# Altium project LedMatrixDisplay.PRJPCB
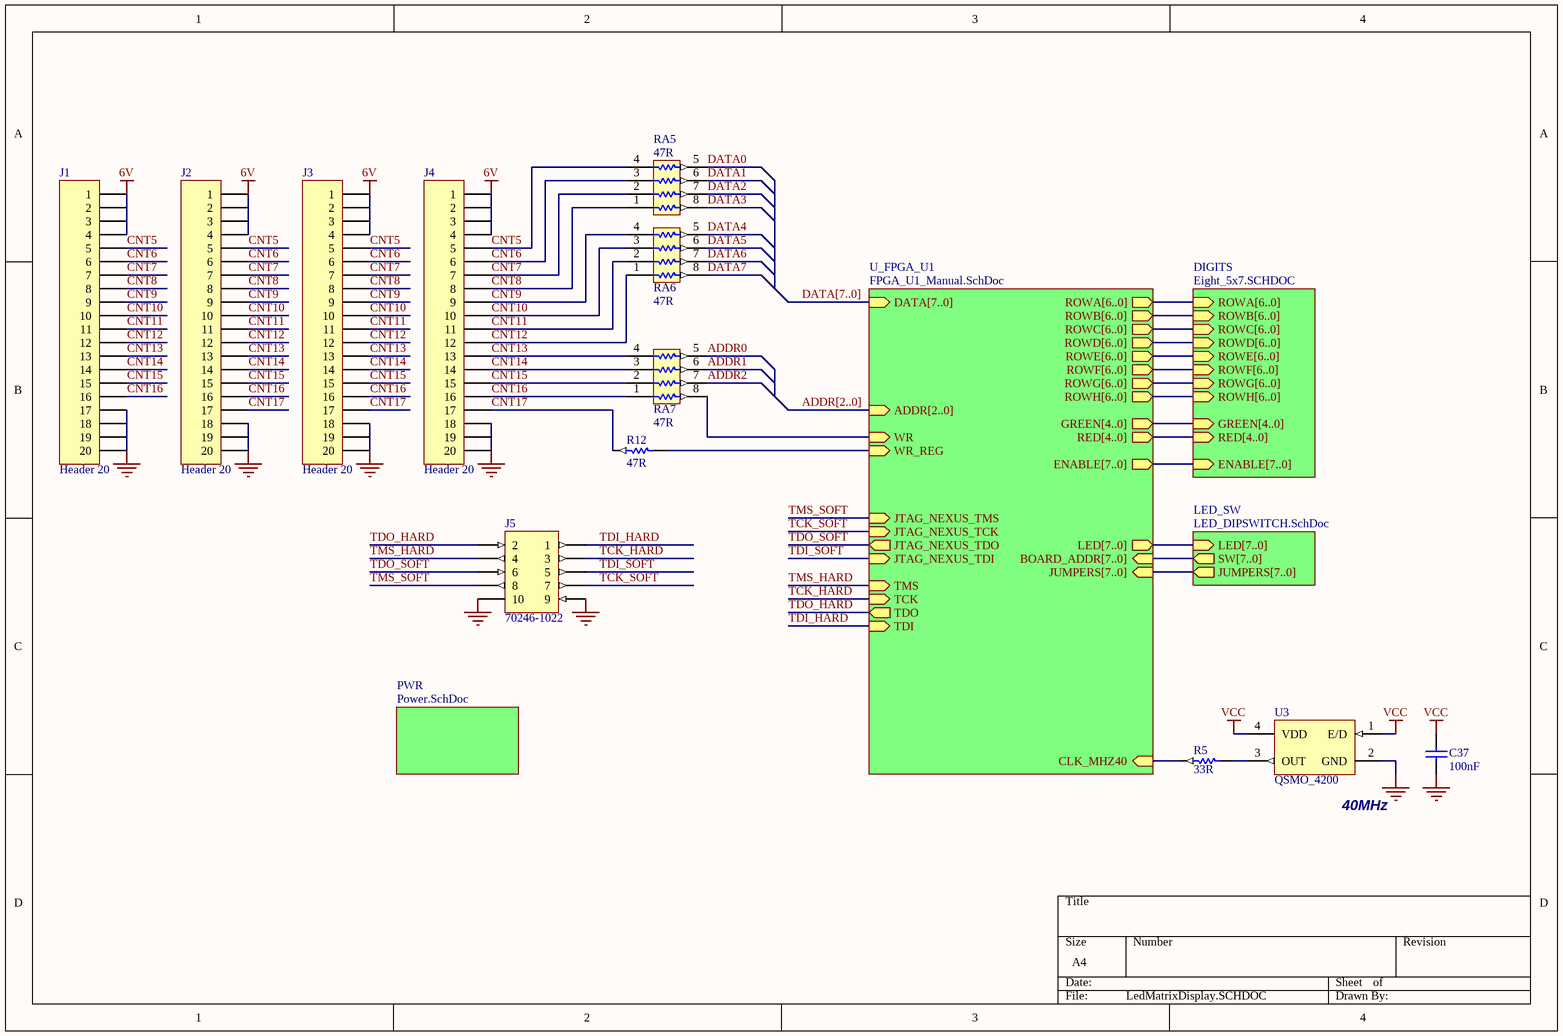
[diagram p0: LedMatrixDisplay.SCHDOC]
7 sheets, 103 parts. Net scope: hierarchical (ports join the sheet entries above them; power ports are global).
Board file: LedMatrixDisplay.PCBDOC
Sheets:
  LedMatrixDisplay.SCHDOC
    DIGITS = Eight_5x7.SCHDOC
      DG7 = DigitHolder.SCHDOC
      DG6 = DigitHolder.SCHDOC
      DG5 = DigitHolder.SCHDOC
      DG4 = DigitHolder.SCHDOC
      DG3 = DigitHolder.SCHDOC
      DG2 = DigitHolder.SCHDOC
      DG1 = DigitHolder.SCHDOC
      DG8 = DigitHolder.SCHDOC
    U_FPGA_U1 = FPGA_U1_Manual.SchDoc
      U_FPGA_U1_Auto = FPGA_U1_Auto.SchDoc
    PWR = Power.SchDoc
    LED_SW = LED_DIPSWITCH.SchDoc

## Sheet LedMatrixDisplay.SCHDOC
size A4; DocumentNumber: 1; SheetNumber: 1; SheetTotal: 7

### Parts
C37  100nF  [CC2012-0805]
J1  Header 20  [HDR2X10]
J2  Header 20  [HDR2X10]
J3  Header 20  [HDR2X10]
J4  Header 20  [HDR2X10]
J5  70246-1022  [HDR2X5_LP]
R5  33R  [CC2012-0805]
R12  47R  [CC2012-0805]
RA5  47R  [MNR34]
RA6  47R  [MNR34]
RA7  47R  [MNR34]
U3  QSMO_4200  [QSMO_4200]

### Sub-sheets
DIGITS = Eight_5x7.SCHDOC: ROWB[6..0] (in), ROWC[6..0] (in), ROWD[6..0] (in), ROWF[6..0] (in), ROWG[6..0] (in), ROWH[6..0] (in), ROWE[6..0] (in), ROWA[6..0] (in), GREEN[4..0] (in), RED[4..0] (in), ENABLE[7..0] (in)
LED_SW = LED_DIPSWITCH.SchDoc: LED[7..0] (in), SW[7..0] (out), JUMPERS[7..0] (out)
PWR = Power.SchDoc: no entries
U_FPGA_U1 = FPGA_U1_Manual.SchDoc: CLK_MHZ40 (in), DATA[7..0] (in), GREEN[4..0] (out), JTAG_NEXUS_TCK (in), JTAG_NEXUS_TDI (in), JTAG_NEXUS_TDO (out), JTAG_NEXUS_TMS (in), RED[4..0] (out), ADDR[2..0] (in), ROWA[6..0] (out), ROWB[6..0] (out), ROWC[6..0] (out), ROWD[6..0] (out), ROWE[6..0] (out), ROWF[6..0] (out), ROWG[6..0] (out), ROWH[6..0] (out), WR (in), TCK (in), TDI (in), TDO (out), TMS (in), BOARD_ADDR[7..0] (in), LED[7..0] (out), ENABLE[7..0] (out), JUMPERS[7..0] (in), WR_REG (in)

### Nets
6V: J1.1 J1.2 J1.3 J1.4 J2.1 J2.2 J2.3 J2.4 J3.1 J3.2 J3.3 J3.4 J4.1 J4.2 J4.3 J4.4
GND: C37.2 J1.17 J1.18 J1.19 J1.20 J2.18 J2.19 J2.20 J3.18 J3.19 J3.20 J4.18 J4.19 J4.20 J5.9 J5.10 U3.2(GND)
VCC: C37.1 U3.1(E/D) U3.4(VDD)  [project net VCCO]
ADDR0: RA7.5
ADDR1: RA7.6
ADDR2: RA7.7
CLK_MHZ40: R5.2 ; sheet U_FPGA_U1/CLK_MHZ40
CNT5: J1.5 J2.5 J3.5 J4.5 RA5.4
CNT6: J1.6 J2.6 J3.6 J4.6 RA5.3
CNT7: J1.7 J2.7 J3.7 J4.7 RA5.2
CNT8: J1.8 J2.8 J3.8 J4.8 RA5.1
CNT9: J1.9 J2.9 J3.9 J4.9 RA6.4
CNT10: J1.10 J2.10 J3.10 J4.10 RA6.3
CNT11: J1.11 J2.11 J3.11 J4.11 RA6.2
CNT12: J1.12 J2.12 J3.12 J4.12 RA6.1
CNT13: J1.13 J2.13 J3.13 J4.13 RA7.4
CNT14: J1.14 J2.14 J3.14 J4.14 RA7.3
CNT15: J1.15 J2.15 J3.15 J4.15 RA7.2
CNT16: J1.16 J2.16 J3.16 J4.16 RA7.1
CNT17: J2.17 J3.17 J4.17 R12.2
DATA0: RA5.5
DATA1: RA5.6
DATA2: RA5.7
DATA3: RA5.8
DATA4: RA6.5
DATA5: RA6.6
DATA6: RA6.7
DATA7: RA6.8
TCK_HARD: J5.3 ; sheet U_FPGA_U1/TCK
TCK_SOFT: J5.7 ; sheet U_FPGA_U1/JTAG_NEXUS_TCK
TDI_HARD: J5.1 ; sheet U_FPGA_U1/TDI
TDI_SOFT: J5.5 ; sheet U_FPGA_U1/JTAG_NEXUS_TDI
TDO_HARD: J5.2 ; sheet U_FPGA_U1/TDO
TDO_SOFT: J5.6 ; sheet U_FPGA_U1/JTAG_NEXUS_TDO
TMS_HARD: J5.4 ; sheet U_FPGA_U1/TMS
TMS_SOFT: J5.8 ; sheet U_FPGA_U1/JTAG_NEXUS_TMS
WR: RA7.8 ; sheet U_FPGA_U1/WR
WR_REG: R12.1 ; sheet U_FPGA_U1/WR_REG
NetR5_1: R5.1 U3.3(OUT)

### Buses and harness runs
bus ADDR[2..0] = sheet U_FPGA_U1/ADDR[2..0]
bus DATA[7..0] = sheet U_FPGA_U1/DATA[7..0]
bus sheet DIGITS/ENABLE[7..0] = sheet U_FPGA_U1/ENABLE[7..0]
bus sheet DIGITS/GREEN[4..0] = sheet U_FPGA_U1/GREEN[4..0]
bus sheet DIGITS/RED[4..0] = sheet U_FPGA_U1/RED[4..0]
bus sheet DIGITS/ROWA[6..0] = sheet U_FPGA_U1/ROWA[6..0]
bus sheet DIGITS/ROWB[6..0] = sheet U_FPGA_U1/ROWB[6..0]
bus sheet DIGITS/ROWC[6..0] = sheet U_FPGA_U1/ROWC[6..0]
bus sheet DIGITS/ROWD[6..0] = sheet U_FPGA_U1/ROWD[6..0]
bus sheet DIGITS/ROWE[6..0] = sheet U_FPGA_U1/ROWE[6..0]
bus sheet DIGITS/ROWF[6..0] = sheet U_FPGA_U1/ROWF[6..0]
bus sheet DIGITS/ROWG[6..0] = sheet U_FPGA_U1/ROWG[6..0]
bus sheet DIGITS/ROWH[6..0] = sheet U_FPGA_U1/ROWH[6..0]
bus sheet LED_SW/JUMPERS[7..0] = sheet U_FPGA_U1/JUMPERS[7..0]
bus sheet LED_SW/LED[7..0] = sheet U_FPGA_U1/LED[7..0]
bus sheet LED_SW/SW[7..0] = sheet U_FPGA_U1/BOARD_ADDR[7..0]

### Notes on the sheet
- (near U3) 40MHz

### Library data of the parts
C37 = CAP: Capacitor; Fitted: False
J1-J4 = Header 20: Header, 20-Pin; Manufacturer: Generic Components; Class I: Connector; Revision: July-2002: Re-released for DXP Platform.; Publisher: Altium Limited
J5 = Header 5X2: Header, 5-Pin, Dual row; Manufacturer: Molex; Class I: Connector; Fitted: True; Revision: July-2002: Re-released for DXP Platform.; Publisher: Altium Limited
R5 R12 = RES: Resistor; Fitted: False
RA5-RA7 = MNR34: 3216x4 Resistor Array; Fitted: True
U3 = QSMO_4200: Surface Mount Crystal Oscillator; Fitted: False

## Sheet Eight_5x7.SCHDOC
size A4 portrait; Organization: Altium Limited; Address1: L3, 12a Rodborough Rd; Address2: Frenchs Forest; Address3: NSW; Address4: Australia 2086; DocumentNumber: 2; SheetNumber: 2; SheetTotal: 7
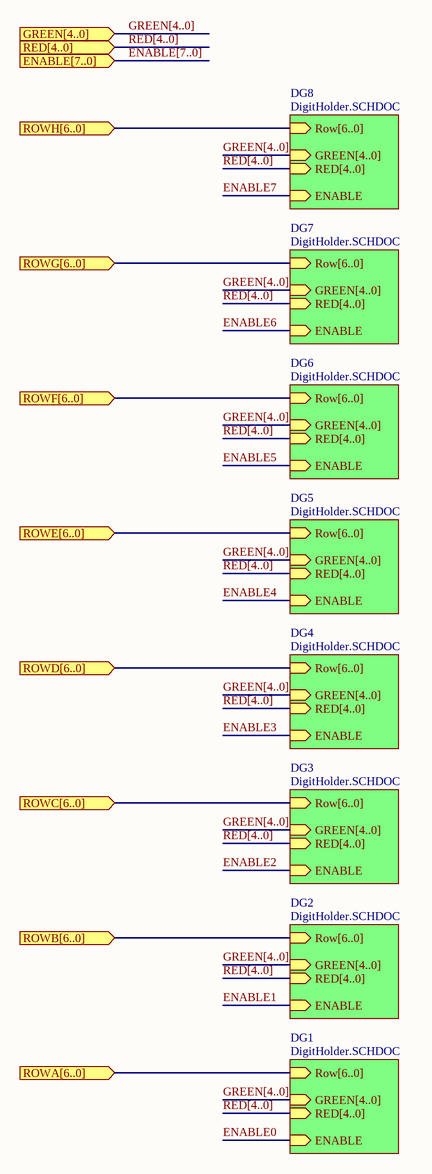
[diagram p1: Eight_5x7.SCHDOC]

### Sub-sheets
DG1 = DigitHolder.SCHDOC: Row[6..0] (in), ENABLE (in), GREEN[4..0] (in), RED[4..0] (in)
DG2 = DigitHolder.SCHDOC: Row[6..0] (in), ENABLE (in), GREEN[4..0] (in), RED[4..0] (in)
DG3 = DigitHolder.SCHDOC: Row[6..0] (in), ENABLE (in), GREEN[4..0] (in), RED[4..0] (in)
DG4 = DigitHolder.SCHDOC: Row[6..0] (in), ENABLE (in), GREEN[4..0] (in), RED[4..0] (in)
DG5 = DigitHolder.SCHDOC: Row[6..0] (in), ENABLE (in), GREEN[4..0] (in), RED[4..0] (in)
DG6 = DigitHolder.SCHDOC: Row[6..0] (in), ENABLE (in), GREEN[4..0] (in), RED[4..0] (in)
DG7 = DigitHolder.SCHDOC: Row[6..0] (in), ENABLE (in), GREEN[4..0] (in), RED[4..0] (in)
DG8 = DigitHolder.SCHDOC: Row[6..0] (in), ENABLE (in), GREEN[4..0] (in), RED[4..0] (in)

### Ports
ENABLE[7..0] (in), GREEN[4..0] (in), RED[4..0] (in), ROWA[6..0] (in), ROWB[6..0] (in), ROWC[6..0] (in), ROWD[6..0] (in), ROWE[6..0] (in), ROWF[6..0] (in), ROWG[6..0] (in), ROWH[6..0] (in)

### Buses and harness runs
bus ENABLE[7..0] = port ENABLE[7..0]
bus GREEN[4..0] = port GREEN[4..0]
bus GREEN[4..0] = sheet DG1/GREEN[4..0]
bus GREEN[4..0] = sheet DG2/GREEN[4..0]
bus GREEN[4..0] = sheet DG3/GREEN[4..0]
bus GREEN[4..0] = sheet DG4/GREEN[4..0]
bus GREEN[4..0] = sheet DG5/GREEN[4..0]
bus GREEN[4..0] = sheet DG6/GREEN[4..0]
bus GREEN[4..0] = sheet DG7/GREEN[4..0]
bus GREEN[4..0] = sheet DG8/GREEN[4..0]
bus port ROWA[6..0] = sheet DG1/Row[6..0]
bus port ROWB[6..0] = sheet DG2/Row[6..0]
bus port ROWC[6..0] = sheet DG3/Row[6..0]
bus port ROWD[6..0] = sheet DG4/Row[6..0]
bus port ROWE[6..0] = sheet DG5/Row[6..0]
bus port ROWF[6..0] = sheet DG6/Row[6..0]
bus port ROWG[6..0] = sheet DG7/Row[6..0]
bus port ROWH[6..0] = sheet DG8/Row[6..0]
bus RED[4..0] = port RED[4..0]
bus RED[4..0] = sheet DG1/RED[4..0]
bus RED[4..0] = sheet DG2/RED[4..0]
bus RED[4..0] = sheet DG3/RED[4..0]
bus RED[4..0] = sheet DG4/RED[4..0]
bus RED[4..0] = sheet DG5/RED[4..0]
bus RED[4..0] = sheet DG6/RED[4..0]
bus RED[4..0] = sheet DG7/RED[4..0]
bus RED[4..0] = sheet DG8/RED[4..0]

### Notes on the sheet
- Title
- Size:
- Date:
- A4
- Number:
- Time:
- Revision:
- Sheet
- of
- File:

## Sheet DigitHolder.SCHDOC
size A4; DocumentNumber: 6; SheetNumber: 6; SheetTotal: 7
Used 8 times, as channels DIGITS/DG7, DIGITS/DG6, DIGITS/DG5, DIGITS/DG4, DIGITS/DG3, DIGITS/DG2, DIGITS/DG1, DIGITS/DG8. Parts and nets are listed once, with the designators drawn on the sheet.
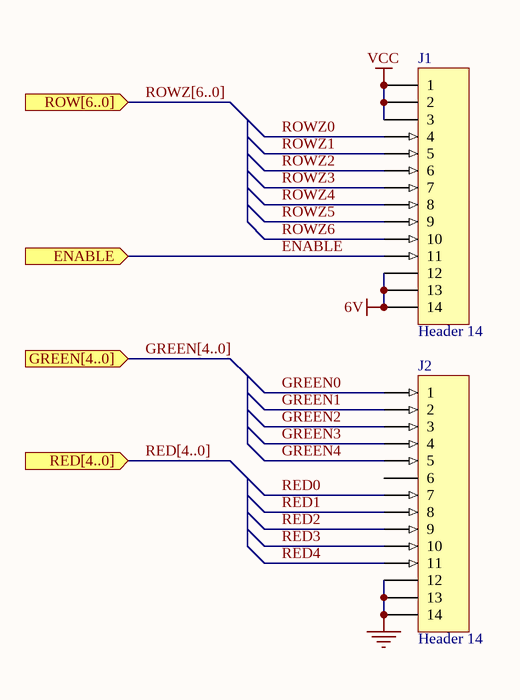
[diagram p2: DigitHolder.SCHDOC]

### Parts
J1  Header 14  [HDR1X14]
J2  Header 14  [HDR1X14]

### Ports
ENABLE (in), GREEN[4..0] (in), RED[4..0] (in), ROW[6..0] (in)

### Nets
6V: J1.12 J1.13 J1.14
GND: J2.12 J2.13 J2.14
VCC: J1.1 J1.2 J1.3
ENABLE: J1.11 ; port ENABLE
GREEN0: J2.1
GREEN1: J2.2
GREEN2: J2.3
GREEN3: J2.4
GREEN4: J2.5
RED0: J2.7
RED1: J2.8
RED2: J2.9
RED3: J2.10
RED4: J2.11
ROWZ0: J1.4
ROWZ1: J1.5
ROWZ2: J1.6
ROWZ3: J1.7
ROWZ4: J1.8
ROWZ5: J1.9
ROWZ6: J1.10

Not connected (* = marked no-connect by the designer): J2 6

### Channels
DIGITS/DG7: designators end in _DG7; ports ENABLE=ENABLE6
DIGITS/DG6: designators end in _DG6; ports ENABLE=ENABLE5
DIGITS/DG5: designators end in _DG5; ports ENABLE=ENABLE4
DIGITS/DG4: designators end in _DG4; ports ENABLE=ENABLE3
DIGITS/DG3: designators end in _DG3; ports ENABLE=ENABLE2
DIGITS/DG2: designators end in _DG2; ports ENABLE=ENABLE1
DIGITS/DG1: designators end in _DG1; ports ENABLE=ENABLE0
DIGITS/DG8: designators end in _DG8; ports ENABLE=ENABLE7

### Buses and harness runs
bus GREEN[4..0] = port GREEN[4..0]
bus RED[4..0] = port RED[4..0]
bus ROWZ[6..0] = port ROW[6..0]

### Library data of the parts
J1 J2 = Header 14: Header, 14-Pin; Manufacturer: Generic Components; Class I: Connector; Revision: July-2002: Re-released for DXP Platform.; Publisher: Altium Limited

## Sheet FPGA_U1_Manual.SchDoc
size A4; DocumentNumber: 4; SheetNumber: 4; SheetTotal: 7
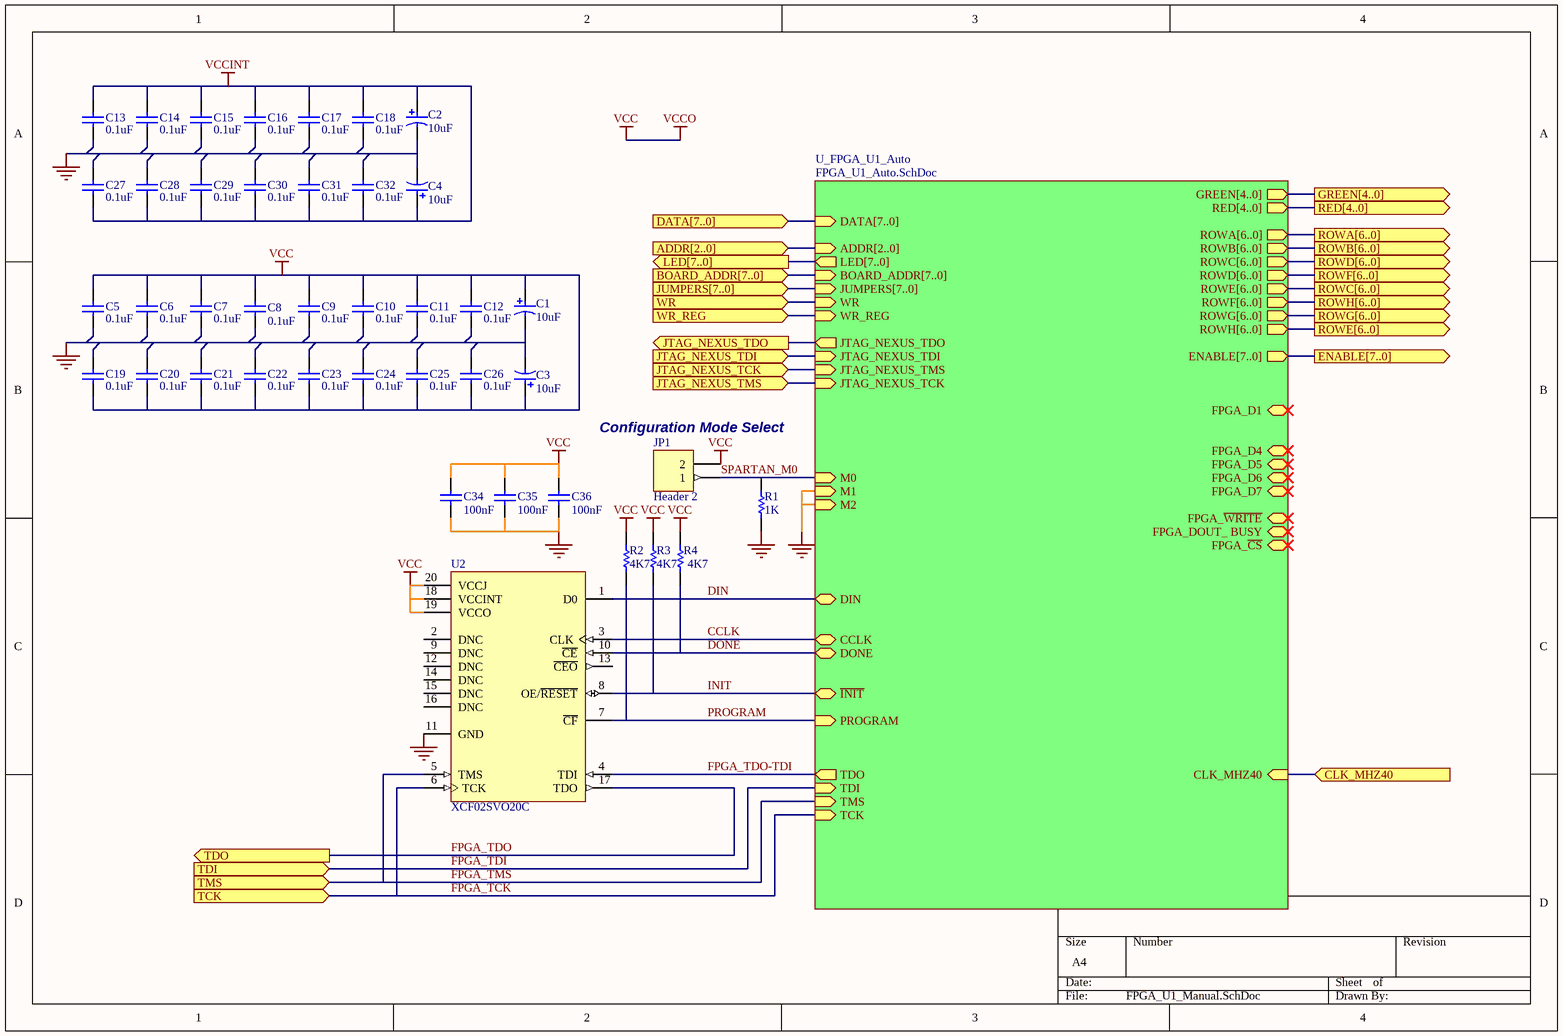
[diagram p3: FPGA_U1_Manual.SchDoc]

### Parts
C1  10uF  [MCCT-B]
C2  10uF  [MCCT-B]
C3  10uF  [MCCT-B]
C4  10uF  [MCCT-B]
C5  0.1uF  [CC2012-0805]
C6  0.1uF  [CC2012-0805]
C7  0.1uF  [CC2012-0805]
C8  0.1uF  [CC2012-0805]
C9  0.1uF  [CC2012-0805]
C10  0.1uF  [CC2012-0805]
C11  0.1uF  [CC2012-0805]
C12  0.1uF  [CC2012-0805]
C13  0.1uF  [CC2012-0805]
C14  0.1uF  [CC2012-0805]
C15  0.1uF  [CC2012-0805]
C16  0.1uF  [CC2012-0805]
C17  0.1uF  [CC2012-0805]
C18  0.1uF  [CC2012-0805]
C19  0.1uF  [CC2012-0805]
C20  0.1uF  [CC2012-0805]
C21  0.1uF  [CC2012-0805]
C22  0.1uF  [CC2012-0805]
C23  0.1uF  [CC2012-0805]
C24  0.1uF  [CC2012-0805]
C25  0.1uF  [CC2012-0805]
C26  0.1uF  [CC2012-0805]
C27  0.1uF  [CC2012-0805]
C28  0.1uF  [CC2012-0805]
C29  0.1uF  [CC2012-0805]
C30  0.1uF  [CC2012-0805]
C31  0.1uF  [CC2012-0805]
C32  0.1uF  [CC2012-0805]
C34  100nF  [CC2012-0805]
C35  100nF  [CC2012-0805]
C36  100nF  [CC2012-0805]
JP1  Header 2  Usage: Configuration Mode Select  [HDR1X2]
R1  1K  [CC2012-0805]
R2  4K7  [CC2012-0805]
R3  4K7  [CC2012-0805]
R4  4K7  [CC2012-0805]
U2  XCF02SVO20C  [VO20]

### Sub-sheets
U_FPGA_U1_Auto = FPGA_U1_Auto.SchDoc: ADDR[2..0] (in), BOARD_ADDR[7..0] (in), CLK_MHZ40 (in), DATA[7..0] (in), GREEN[4..0] (out), JTAG_NEXUS_TCK (in), JTAG_NEXUS_TDI (in), JTAG_NEXUS_TDO (out), JTAG_NEXUS_TMS (in), LED[7..0] (out), RED[4..0] (out), ROWA[6..0] (out), ROWB[6..0] (out), ROWC[6..0] (out), ROWD[6..0] (out), ROWE[6..0] (out), ROWF[6..0] (out), ROWG[6..0] (out), ROWH[6..0] (out), WR (in), CCLK (bidir), DONE (bidir), FPGA_D7 (bidir), M0 (in), M1 (in), M2 (in), PROGRAM (in), TCK (in), TDI (in), TDO (out), TMS (in), FPGA_DOUT_ BUSY (bidir), FPGA_~{WRITE} (bidir), FPGA_D5 (bidir), FPGA_D6 (bidir), FPGA_~{CS} (bidir), FPGA_D1 (bidir), FPGA_D4 (bidir), ENABLE[7..0] (out), JUMPERS[7..0] (in), DIN (bidir), ~{INIT} (bidir), WR_REG (in)

### Ports
ADDR[2..0] (in), BOARD_ADDR[7..0] (in), CLK_MHZ40 (in), DATA[7..0] (in), ENABLE[7..0] (out), GREEN[4..0] (out), JTAG_NEXUS_TCK (in), JTAG_NEXUS_TDI (in), JTAG_NEXUS_TDO (out), JTAG_NEXUS_TMS (in), JUMPERS[7..0] (in), LED[7..0] (out), RED[4..0] (out), ROWA[6..0] (out), ROWB[6..0] (out), ROWC[6..0] (out), ROWD[6..0] (out), ROWE[6..0] (out), ROWF[6..0] (out), ROWG[6..0] (out), ROWH[6..0] (out), TCK (in), TDI (in), TDO (out), TMS (in), WR (in), WR_REG (in)

### Nets
GND: C1.2 C2.2 C3.2 C4.2 C5.1 C6.1 C7.1 C8.1 C9.1 C10.1 C11.1 C12.1 C13.1 C14.1 C15.1 C16.1 C17.1 C18.1 C19.2 C20.2 C21.2 C22.2 C23.2 C24.2 C25.2 C26.2 C27.2 C28.2 C29.2 C30.2 C31.2 C32.2 C34.1 C35.1 C36.1 R1.1 U2.11(GND) ; sheet U_FPGA_U1_Auto/M1, sheet U_FPGA_U1_Auto/M2
VCCINT: C2.1 C4.1 C13.2 C14.2 C15.2 C16.2 C17.2 C18.2 C27.1 C28.1 C29.1 C30.1 C31.1 C32.1
VCCO: C1.1 C3.1 C5.2 C6.2 C7.2 C8.2 C9.2 C10.2 C11.2 C12.2 C19.1 C20.1 C21.1 C22.1 C23.1 C24.1 C25.1 C26.1 C34.2 C35.2 C36.2 JP1.2 R2.1 R3.1 R4.1 U2.18(VCCINT) U2.19(VCCO) U2.20(VCCJ)  [also labelled VCC]
CCLK: U2.3(CLK) ; sheet U_FPGA_U1_Auto/CCLK
CLK_MHZ40: port CLK_MHZ40, sheet U_FPGA_U1_Auto/CLK_MHZ40
DIN: U2.1(D0) ; sheet U_FPGA_U1_Auto/DIN
DONE: R4.2 U2.10(~{CE}) ; sheet U_FPGA_U1_Auto/DONE
FPGA_TCK: U2.6(TCK) ; port TCK, sheet U_FPGA_U1_Auto/TCK  [project net TCK_HARD]
FPGA_TDI: port TDI, sheet U_FPGA_U1_Auto/TDI  [project net TDI_HARD]
FPGA_TDO: U2.17(TDO) ; port TDO  [project net TDO_HARD]
FPGA_TDO-TDI: U2.4(TDI) ; sheet U_FPGA_U1_Auto/TDO
FPGA_TMS: U2.5(TMS) ; port TMS, sheet U_FPGA_U1_Auto/TMS  [project net TMS_HARD]
INIT: R3.2 U2.8(OE/~{RESET}) ; sheet U_FPGA_U1_Auto/~{INIT}
PROGRAM: R2.2 U2.7(~{CF}) ; sheet U_FPGA_U1_Auto/PROGRAM
SPARTAN_M0: JP1.1 R1.2 ; sheet U_FPGA_U1_Auto/M0
TCK_SOFT: port JTAG_NEXUS_TCK, sheet U_FPGA_U1_Auto/JTAG_NEXUS_TMS
TDI_SOFT: port JTAG_NEXUS_TDI, sheet U_FPGA_U1_Auto/JTAG_NEXUS_TDI
TDO_SOFT: port JTAG_NEXUS_TDO, sheet U_FPGA_U1_Auto/JTAG_NEXUS_TDO
TMS_SOFT: port JTAG_NEXUS_TMS, sheet U_FPGA_U1_Auto/JTAG_NEXUS_TCK
WR: port WR, sheet U_FPGA_U1_Auto/WR
WR_REG: port WR_REG, sheet U_FPGA_U1_Auto/WR_REG

Not connected (* = marked no-connect by the designer): U2 2(DNC) 9(DNC) 12(DNC) 13(~{CEO}) 14(DNC) 15(DNC) 16(DNC)

### Buses and harness runs
bus port ADDR[2..0] = sheet U_FPGA_U1_Auto/ADDR[2..0]
bus port BOARD_ADDR[7..0] = sheet U_FPGA_U1_Auto/BOARD_ADDR[7..0]
bus port DATA[7..0] = sheet U_FPGA_U1_Auto/DATA[7..0]
bus port ENABLE[7..0] = sheet U_FPGA_U1_Auto/ENABLE[7..0]
bus port GREEN[4..0] = sheet U_FPGA_U1_Auto/GREEN[4..0]
bus port JUMPERS[7..0] = sheet U_FPGA_U1_Auto/JUMPERS[7..0]
bus port LED[7..0] = sheet U_FPGA_U1_Auto/LED[7..0]
bus port RED[4..0] = sheet U_FPGA_U1_Auto/RED[4..0]
bus port ROWA[6..0] = sheet U_FPGA_U1_Auto/ROWA[6..0]
bus port ROWB[6..0] = sheet U_FPGA_U1_Auto/ROWB[6..0]
bus port ROWC[6..0] = sheet U_FPGA_U1_Auto/ROWE[6..0]
bus port ROWD[6..0] = sheet U_FPGA_U1_Auto/ROWC[6..0]
bus port ROWE[6..0] = sheet U_FPGA_U1_Auto/ROWH[6..0]
bus port ROWF[6..0] = sheet U_FPGA_U1_Auto/ROWD[6..0]
bus port ROWG[6..0] = sheet U_FPGA_U1_Auto/ROWG[6..0]
bus port ROWH[6..0] = sheet U_FPGA_U1_Auto/ROWF[6..0]

### Library data of the parts
C1-C4 = CAP_POLAR: Polar Capacitor
  C2-C4: Supplier: FARNELL; Supplier Code: 967-117
C5-C32 = CAP: Capacitor; Supplier: FARNELL; Supplier Code: 317-287
C34-C36 = CAP: Capacitor; Fitted: True
JP1 = Header 2: Header, 2-Pin; Manufacturer: Generic Components; Class I: Connector; Fitted: True; Revision: July-2002: Re-released for DXP Platform.; Publisher: Altium Limited
R1-R4 = RES: Resistor; Fitted: True
U2 = XCF02SVO20C: XCF00S Series, Platform Flash In-System Programmable Configuration 3.3V PROM, 20-Pin TSOP, 2-Megabit, Commercial Grade; Manufacturer: Xilinx; Package Information: Latest Revision: ver1.0, May-2003; Code - JEDEC: MO-153-AC; Published: 17-Sep-2003; Datasheet: Latest Revision: ver1.1, Jun-2003; Package Reference: VO20; Publisher: Altium Limited

## Sheet FPGA_U1_Auto.SchDoc
size A2; DocumentNumber: 7; SheetNumber: 7; SheetTotal: 7; Generated From FPGA Project: LedMatrix.PrjFpg; UNUSED_SPECIAL: RouteSeparate; UNUSED_IO: NoERC; VREF: NoERC; UNUSED_INPUT: NoERC
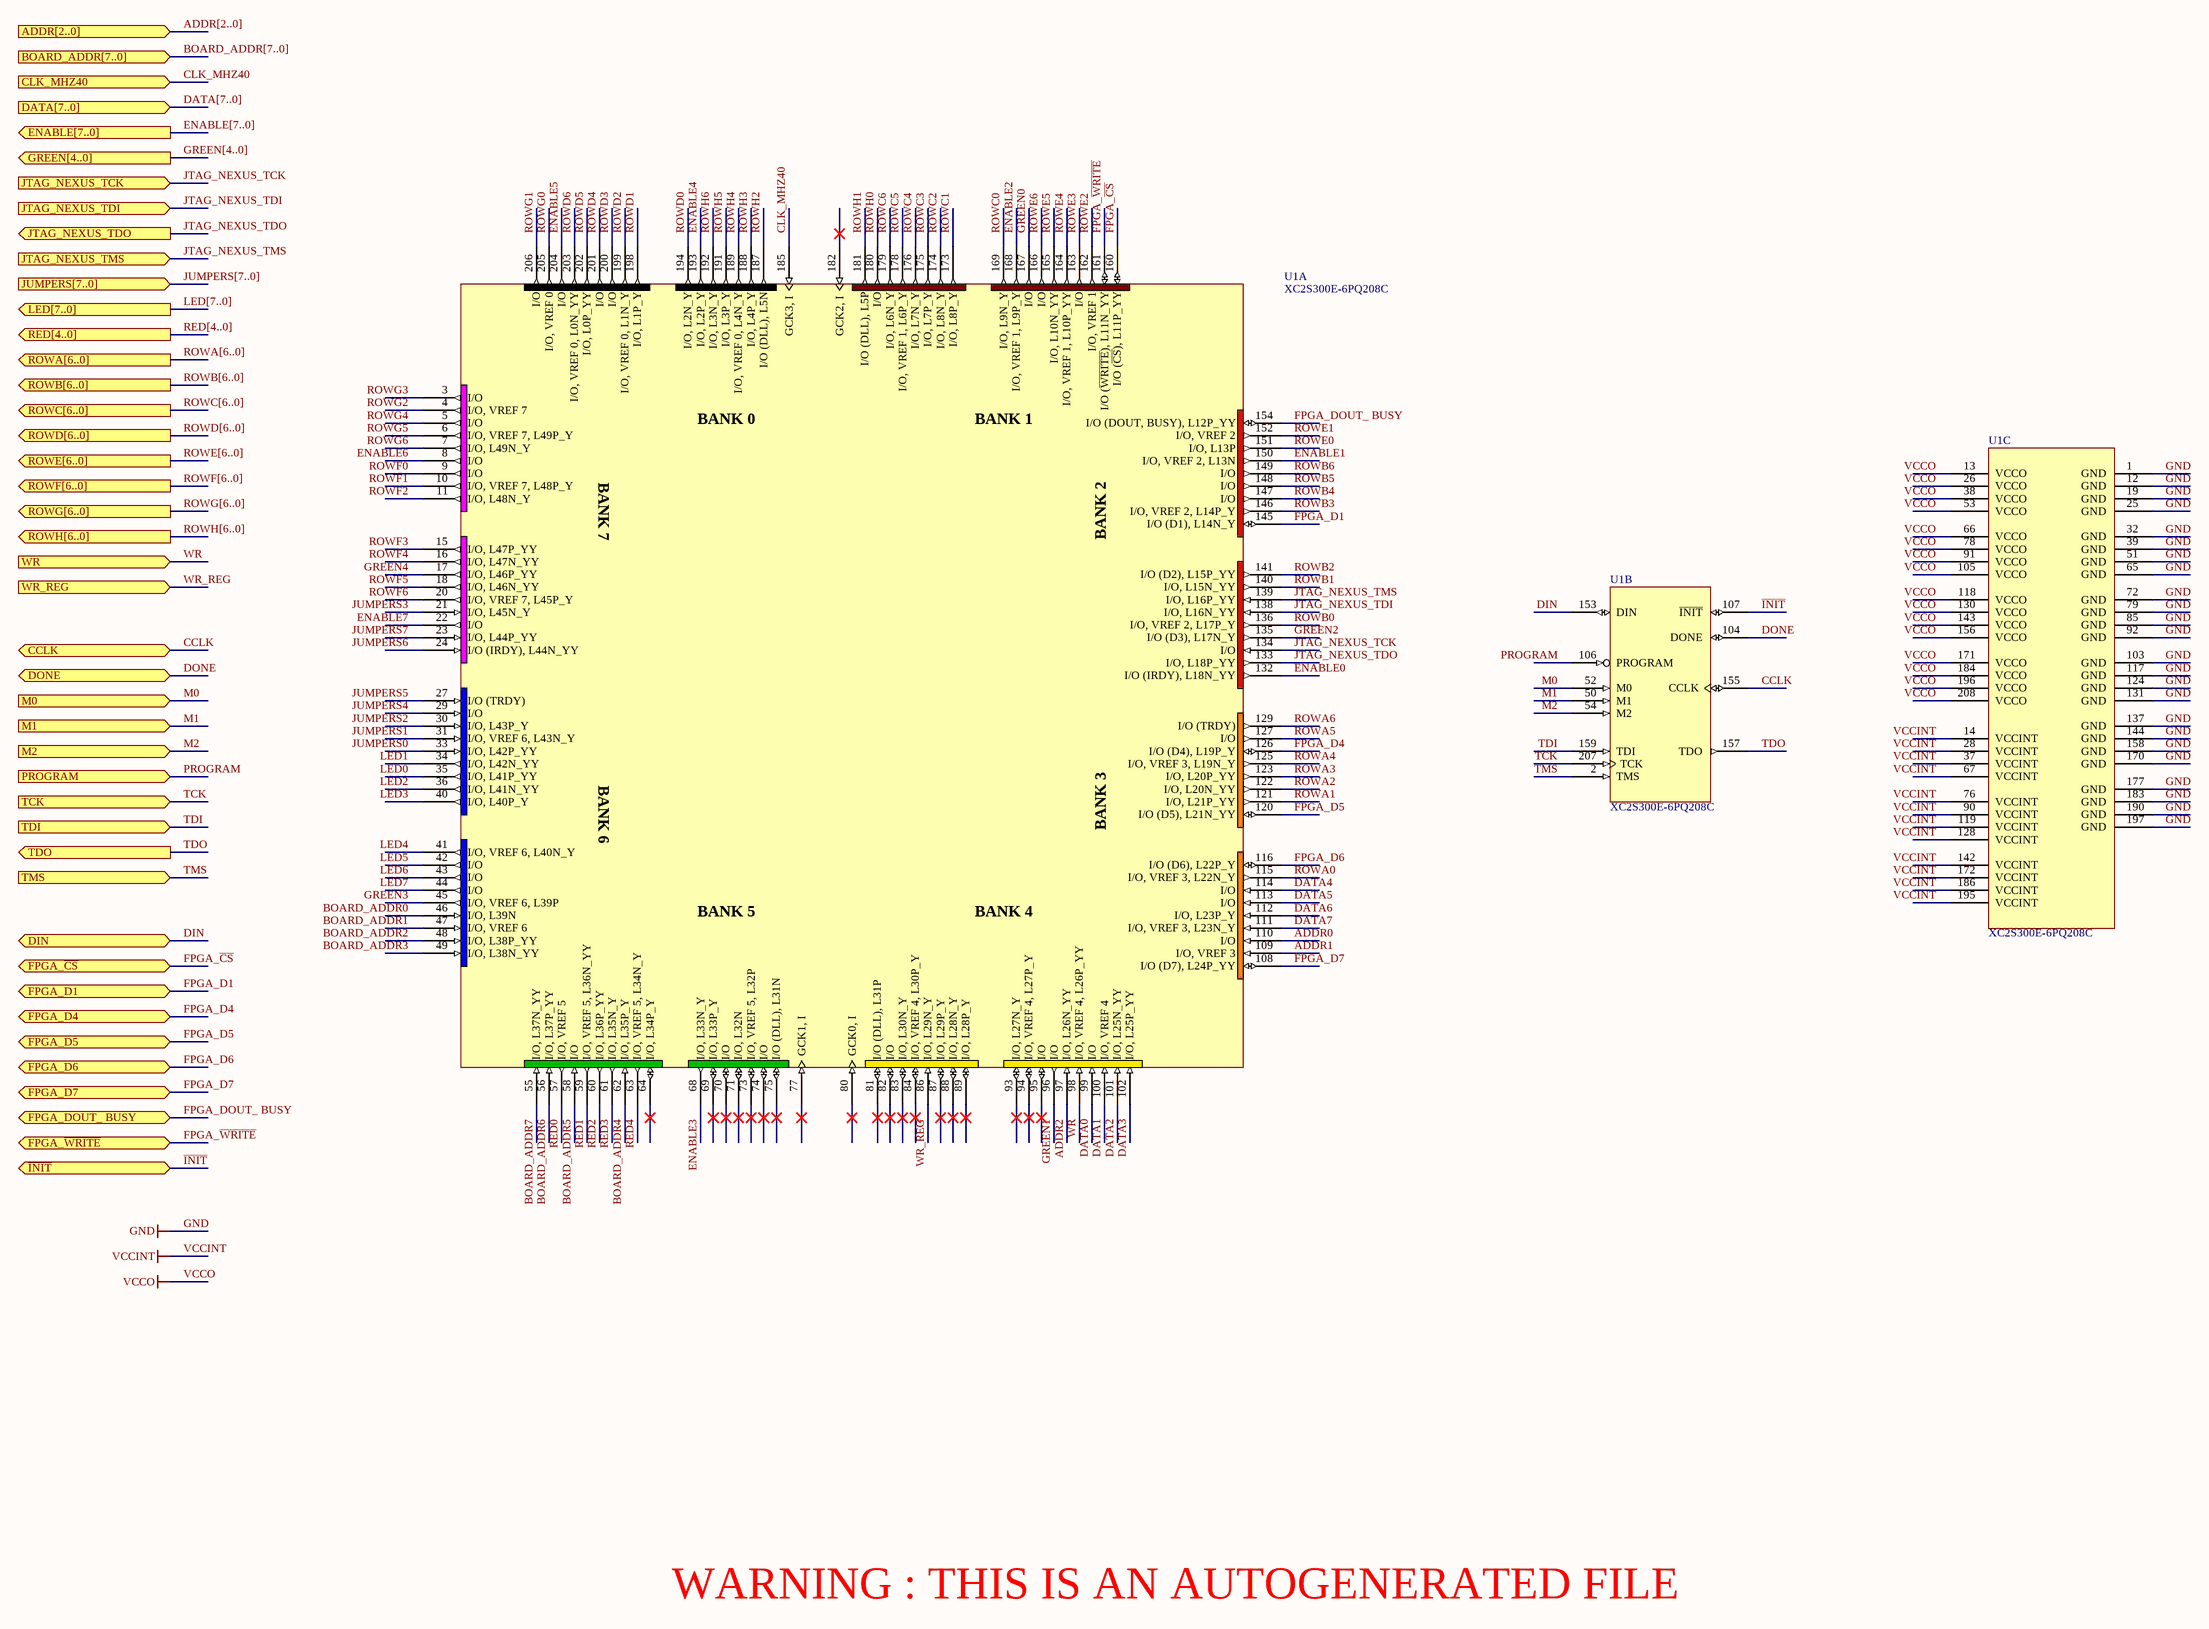
[diagram p4: FPGA_U1_Auto.SchDoc]

### Parts
U1  XC2S300E-6PQ208C  [PQ208]  (parts A,B,C of 3)

### Ports
ADDR[2..0] (in), BOARD_ADDR[7..0] (in), CCLK (bidir), CLK_MHZ40 (in), DATA[7..0] (in), DIN (bidir), DONE (bidir), ENABLE[7..0] (out), FPGA_D1 (bidir), FPGA_D4 (bidir), FPGA_D5 (bidir), FPGA_D6 (bidir), FPGA_D7 (bidir), FPGA_DOUT_ BUSY (bidir), FPGA_~{CS} (bidir), FPGA_~{WRITE} (bidir), GREEN[4..0] (out), JTAG_NEXUS_TCK (in), JTAG_NEXUS_TDI (in), JTAG_NEXUS_TDO (out), JTAG_NEXUS_TMS (in), JUMPERS[7..0] (in), LED[7..0] (out), M0 (in), M1 (in), M2 (in), PROGRAM (in), RED[4..0] (out), ROWA[6..0] (out), ROWB[6..0] (out), ROWC[6..0] (out), ROWD[6..0] (out), ROWE[6..0] (out), ROWF[6..0] (out), ROWG[6..0] (out), ROWH[6..0] (out), TCK (in), TDI (in), TDO (out), TMS (in), WR (in), WR_REG (in), ~{INIT} (bidir)

### Nets
GND: U1.1(GND) U1.12(GND) U1.19(GND) U1.25(GND) U1.32(GND) U1.39(GND) U1.50(M1) U1.51(GND) U1.54(M2) U1.65(GND) U1.72(GND) U1.79(GND) U1.85(GND) U1.92(GND) U1.103(GND) U1.117(GND) U1.124(GND) U1.131(GND) U1.137(GND) U1.144(GND) U1.158(GND) U1.170(GND) U1.177(GND) U1.183(GND) U1.190(GND) U1.197(GND) ; port M1, port M2  [also labelled M1, M2]
VCCINT: U1.14(VCCINT) U1.28(VCCINT) U1.37(VCCINT) U1.67(VCCINT) U1.76(VCCINT) U1.90(VCCINT) U1.119(VCCINT) U1.128(VCCINT) U1.142(VCCINT) U1.172(VCCINT) U1.186(VCCINT) U1.195(VCCINT)
VCCO: U1.13(VCCO) U1.26(VCCO) U1.38(VCCO) U1.53(VCCO) U1.66(VCCO) U1.78(VCCO) U1.91(VCCO) U1.105(VCCO) U1.118(VCCO) U1.130(VCCO) U1.143(VCCO) U1.156(VCCO) U1.171(VCCO) U1.184(VCCO) U1.196(VCCO) U1.208(VCCO)
ADDR0: U1.110(I/O)
ADDR1: U1.109(I/O,_VREF_3)
ADDR2: U1.97(I/O,_L26N_YY)
BOARD_ADDR0: U1.46(I/O,_L39N)  [project net SW0]
BOARD_ADDR1: U1.47(I/O,_VREF_6)  [project net SW1]
BOARD_ADDR2: U1.48(I/O,_L38P_YY)  [project net SW2]
BOARD_ADDR3: U1.49(I/O,_L38N_YY)  [project net SW3]
BOARD_ADDR4: U1.62(I/O,_L35P_Y)  [project net SW4]
BOARD_ADDR5: U1.58(I/O)  [project net SW5]
BOARD_ADDR6: U1.56(I/O,_L37P_YY)  [project net SW6]
BOARD_ADDR7: U1.55(I/O,_L37N_YY)  [project net SW7]
CCLK: U1.155(CCLK) ; port CCLK
CLK_MHZ40: U1.185(GCK3,_I) ; port CLK_MHZ40
DATA0: U1.99(I/O)
DATA1: U1.100(I/O,_VREF_4)
DATA2: U1.101(I/O,_L25N_YY)
DATA3: U1.102(I/O,_L25P_YY)
DATA4: U1.114(I/O)
DATA5: U1.113(I/O)
DATA6: U1.112(I/O,_L23P_Y)
DATA7: U1.111(I/O,_VREF_3,_L23N_Y)
DIN: U1.153(DIN) ; port DIN
DONE: U1.104(DONE) ; port DONE
ENABLE0: U1.132(I/O_(IRDY),_L18N_YY)
ENABLE1: U1.150(I/O,_VREF_2,_L13N)
ENABLE2: U1.168(I/O,_VREF_1,_L9P_Y)
ENABLE3: U1.68(I/O,_L33N_Y)
ENABLE4: U1.193(I/O,_L2P_Y)
ENABLE5: U1.204(I/O)
ENABLE6: U1.8(I/O)
ENABLE7: U1.22(I/O)
FPGA_~{CS}: U1.160(I/O_(~{CS}),_L11P_YY) ; port FPGA_~{CS}
FPGA_D1: U1.145(I/O_(D1),_L14N_Y) ; port FPGA_D1
FPGA_D4: U1.126(I/O_(D4),_L19P_Y) ; port FPGA_D4
FPGA_D5: U1.120(I/O_(D5),_L21N_YY) ; port FPGA_D5
FPGA_D6: U1.116(I/O_(D6),_L22P_Y) ; port FPGA_D6
FPGA_D7: U1.108(I/O_(D7),_L24P_YY) ; port FPGA_D7
FPGA_DOUT_ BUSY: U1.154(I/O_(DOUT,_BUSY),_L12P_YY) ; port FPGA_DOUT_ BUSY
FPGA_~{WRITE}: U1.161(I/O_(~{WRITE}),_L11N_YY) ; port FPGA_~{WRITE}
GREEN0: U1.167(I/O)
GREEN1: U1.96(I/O)
GREEN2: U1.135(I/O_(D3),_L17N_Y)
GREEN3: U1.45(I/O,_VREF_6,_L39P)
GREEN4: U1.17(I/O,_L46P_YY)
~{INIT}: U1.107(~{INIT}) ; port ~{INIT}  [project net INIT]
JTAG_NEXUS_TCK: U1.134(I/O) ; port JTAG_NEXUS_TCK  [project net TMS_SOFT]
JTAG_NEXUS_TDI: U1.138(I/O,_L16N_YY) ; port JTAG_NEXUS_TDI  [project net TDI_SOFT]
JTAG_NEXUS_TDO: U1.133(I/O,_L18P_YY) ; port JTAG_NEXUS_TDO  [project net TDO_SOFT]
JTAG_NEXUS_TMS: U1.139(I/O,_L16P_YY) ; port JTAG_NEXUS_TMS  [project net TCK_SOFT]
JUMPERS0: U1.33(I/O,_L42P_YY)
JUMPERS1: U1.31(I/O,_VREF_6,_L43N_Y)
JUMPERS2: U1.30(I/O,_L43P_Y)
JUMPERS3: U1.21(I/O,_L45N_Y)
JUMPERS4: U1.29(I/O)
JUMPERS5: U1.27(I/O_(TRDY))
JUMPERS6: U1.24(I/O_(IRDY),_L44N_YY)
JUMPERS7: U1.23(I/O,_L44P_YY)
LED0: U1.35(I/O,_L41P_YY)
LED1: U1.34(I/O,_L42N_YY)
LED2: U1.36(I/O,_L41N_YY)
LED3: U1.40(I/O,_L40P_Y)
LED4: U1.41(I/O,_VREF_6,_L40N_Y)
LED5: U1.42(I/O)
LED6: U1.43(I/O)
LED7: U1.44(I/O)
M0: U1.52(M0) ; port M0  [project net SPARTAN_M0]
PROGRAM: U1.106(PROGRAM) ; port PROGRAM
RED0: U1.57(I/O,_VREF_5)
RED1: U1.59(I/O,_VREF_5,_L36N_YY)
RED2: U1.60(I/O,_L36P_YY)
RED3: U1.61(I/O,_L35N_Y)
RED4: U1.63(I/O,_VREF_5,_L34N_Y)
ROWA0: U1.115(I/O,_VREF_3,_L22N_Y)
ROWA1: U1.121(I/O,_L21P_YY)
ROWA2: U1.122(I/O,_L20N_YY)
ROWA3: U1.123(I/O,_L20P_YY)
ROWA4: U1.125(I/O,_VREF_3,_L19N_Y)
ROWA5: U1.127(I/O)
ROWA6: U1.129(I/O_(TRDY))
ROWB0: U1.136(I/O,_VREF_2,_L17P_Y)
ROWB1: U1.140(I/O,_L15N_YY)
ROWB2: U1.141(I/O_(D2),_L15P_YY)
ROWB3: U1.146(I/O,_VREF_2,_L14P_Y)
ROWB4: U1.147(I/O)
ROWB5: U1.148(I/O)
ROWB6: U1.149(I/O)
ROWC0: U1.169(I/O,_L9N_Y)
ROWC1: U1.173(I/O,_L8P_Y)
ROWC2: U1.174(I/O,_L8N_Y)
ROWC3: U1.175(I/O,_L7P_Y)
ROWC4: U1.176(I/O,_L7N_Y)
ROWC5: U1.178(I/O,_VREF_1,_L6P_Y)
ROWC6: U1.179(I/O,_L6N_Y)
ROWD0: U1.194(I/O,_L2N_Y)
ROWD1: U1.198(I/O,_L1P_Y)
ROWD2: U1.199(I/O,_VREF_0,_L1N_Y)
ROWD3: U1.200(I/O)
ROWD4: U1.201(I/O)
ROWD5: U1.202(I/O,_L0P_YY)
ROWD6: U1.203(I/O,_VREF_0,_L0N_YY)
ROWE0: U1.151(I/O,_L13P)
ROWE1: U1.152(I/O,_VREF_2)
ROWE2: U1.162(I/O,_VREF_1)
ROWE3: U1.163(I/O)
ROWE4: U1.164(I/O,_VREF_1,_L10P_YY)
ROWE5: U1.165(I/O,_L10N_YY)
ROWE6: U1.166(I/O)
ROWF0: U1.9(I/O)
ROWF1: U1.10(I/O,_VREF_7,_L48P_Y)
ROWF2: U1.11(I/O,_L48N_Y)
ROWF3: U1.15(I/O,_L47P_YY)
ROWF4: U1.16(I/O,_L47N_YY)
ROWF5: U1.18(I/O,_L46N_YY)
ROWF6: U1.20(I/O,_VREF_7,_L45P_Y)
ROWG0: U1.205(I/O,_VREF_0)
ROWG1: U1.206(I/O)
ROWG2: U1.4(I/O,_VREF_7)
ROWG3: U1.3(I/O)
ROWG4: U1.5(I/O)
ROWG5: U1.6(I/O,_VREF_7,_L49P_Y)
ROWG6: U1.7(I/O,_L49N_Y)
ROWH0: U1.180(I/O)
ROWH1: U1.181(I/O_(DLL),_L5P)
ROWH2: U1.187(I/O_(DLL),_L5N)
ROWH3: U1.188(I/O,_L4P_Y)
ROWH4: U1.189(I/O,_VREF_0,_L4N_Y)
ROWH5: U1.191(I/O,_L3P_Y)
ROWH6: U1.192(I/O,_L3N_Y)
TCK: U1.207(TCK) ; port TCK  [project net TCK_HARD]
TDI: U1.159(TDI) ; port TDI  [project net TDI_HARD]
TDO: U1.157(TDO) ; port TDO  [project net FPGA_TDO-TDI]
TMS: U1.2(TMS) ; port TMS  [project net TMS_HARD]
WR: U1.98(I/O,_VREF_4,_L26P_YY) ; port WR
WR_REG: U1.86(I/O,_L29N_Y) ; port WR_REG

Not connected (* = marked no-connect by the designer): U1 64(I/O,_L34P_Y)* 69(I/O,_L33P_Y)* 70(I/O)* 71(I/O,_L32N)* 73(I/O,_VREF_5,_L32P)* 74(I/O)* 75(I/O_(DLL),_L31N)* 77(GCK1,_I)* 80(GCK0,_I)* 81(I/O_(DLL),_L31P)* 82(I/O)* 83(I/O,_L30N_Y)* 84(I/O,_VREF_4,_L30P_Y)* 87(I/O,_L29P_Y)* 88(I/O,_L28N_Y)* 89(I/O,_L28P_Y)* 93(I/O,_L27N_Y)* 94(I/O,_VREF_4,_L27P_Y)* 95(I/O)* 182(GCK2,_I)*

### Buses and harness runs
bus ADDR[2..0] = port ADDR[2..0]
bus BOARD_ADDR[7..0] = port BOARD_ADDR[7..0]
bus DATA[7..0] = port DATA[7..0]
bus ENABLE[7..0] = port ENABLE[7..0]
bus GREEN[4..0] = port GREEN[4..0]
bus JUMPERS[7..0] = port JUMPERS[7..0]
bus LED[7..0] = port LED[7..0]
bus RED[4..0] = port RED[4..0]
bus ROWA[6..0] = port ROWA[6..0]
bus ROWB[6..0] = port ROWB[6..0]
bus ROWC[6..0] = port ROWC[6..0]
bus ROWD[6..0] = port ROWD[6..0]
bus ROWE[6..0] = port ROWE[6..0]
bus ROWF[6..0] = port ROWF[6..0]
bus ROWG[6..0] = port ROWG[6..0]
bus ROWH[6..0] = port ROWH[6..0]

### Notes on the sheet
- WARNING : THIS IS AN AUTOGENERATED FILE
- (in symbol XC2S300E-6PQ208C, part A) BANK 0; BANK 1; BANK 7; BANK 2; BANK 6; BANK 3; BANK 5; BANK 4

### Library data of the parts
U1 = XC2S300E-6PQ208C: Spartan-IIE 1.8V FPGA, 208-Pin PQFP, Standard Performance, Commercial Grade; Package Information: Latest Revision: ver1.1, Oct-2002; Code - JEDEC: MS-029-FA-1; Published: 19-Jul-2002; Revision: 17-Sep-2003: Pin names updated to match datasheet, ver2.1.; Datasheet: Latest Revision: 09-Jul-2003; Package Reference: PQ208; Publisher: Altium Limited

## Sheet Power.SchDoc: Board-On-Chip Power Supply
size A4; Organization: Altium Limited; Address1: L3, 12a Rodborough Rd; Address2: Frenchs Forest; Address3: NSW; Address4: Australia 2086; DocumentNumber: 3; Revision: 1.05; SheetNumber: 3; SheetTotal: 7
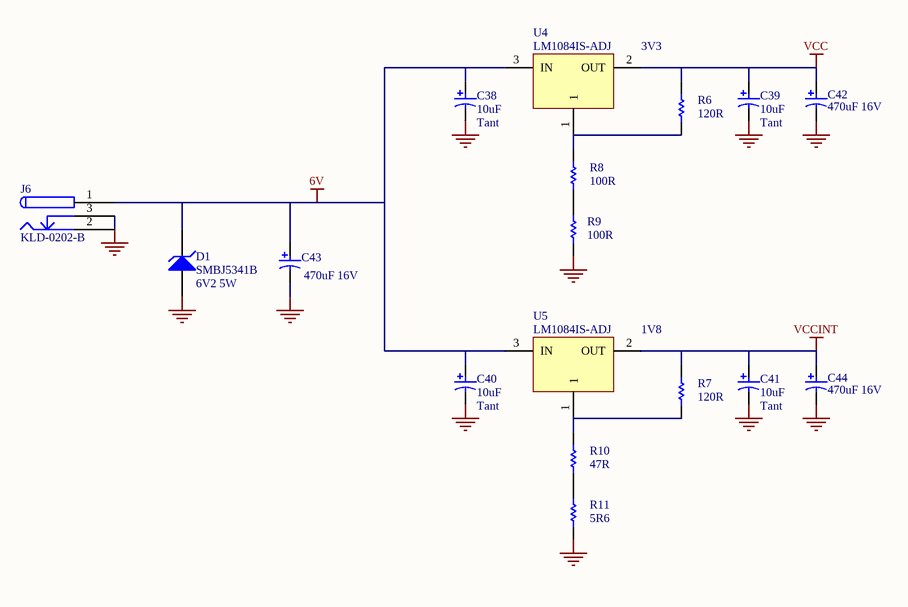
[diagram p5: Power.SchDoc]

### Parts
C38  10uF  Capacitor Type: Tant  [MCCT-B]
C39  10uF  Capacitor Type: Tant  [MCCT-B]
C40  10uF  Capacitor Type: Tant  [MCCT-B]
C41  10uF  Capacitor Type: Tant  [MCCT-B]
C42  470uF 16V  [RB8/3.5]
C43  470uF 16V  [RB8/3.5]
C44  470uF 16V  [RB8/3.5]
D1  SMBJ5341B  Part Description: 6V2 5W  [DO214]
J6  KLD-0202-B  [KLD-0202]
R6  120R  [CC2012-0805]
R7  120R  [CC2012-0805]
R8  100R  [CC2012-0805]
R9  100R  [CC2012-0805]
R10  47R  [CC2012-0805]
R11  5R6  [CC2012-0805]
U4  LM1084IS-ADJ  [TO-263]
U5  LM1084IS-ADJ  [TO-263]

### Nets
6V: C38.1 C40.1 C43.1 D1.2(K) J6.1 J6.1A J6.1B U4.3(IN) U5.3(IN)
GND: C38.2 C39.2 C40.2 C41.2 C42.2 C43.2 C44.2 D1.1(A) J6.2 J6.2A J6.2B J6.3 J6.3A J6.3B R9.1 R11.2
VCC: C39.1 C42.1 R6.1 U4.2(OUT)  [project net VCCO]
VCCINT: C41.1 C44.1 R7.1 U5.2(OUT)
NetR6_2: R6.2 R8.1 U4.1
NetR7_2: R7.2 R10.1 U5.1
NetR8_2: R8.2 R9.2
NetR10_2: R10.2 R11.1

### Notes on the sheet
- 3V3
- 1V8
- Title
- Size:
- Date:
- A
- Number:
- Time:
- Revision:
- Sheet
- of
- File:

### Library data of the parts
C38-C44 = CAP_POLAR: Polar Capacitor; Fitted: True
D1 = BZG03C13: Zener Diode, 6.2V, 5W; Manufacturer: Microsemi; Fitted: True; Revision: 31-Oct-2003
J6 = KLD-0202-B: Low Voltage Power Supply Connector; Manufacturer: Kycon; Fitted: True
R6-R11 = RES: Resistor; Fitted: True
U4 U5 = LM1084IS-ADJ: 5A Low Dropout Possitive Regulators; Fitted: True

## Sheet LED_DIPSWITCH.SchDoc: Board-On-Chip LEDs and DIP Switch
size A4; Organization: Altium Limited; Address1: L3, 12a Rodborough Rd; Address2: Frenchs Forest; Address3: NSW; Address4: Australia 2086; DocumentNumber: 5; Revision: 1.05; SheetNumber: 5; SheetTotal: 7
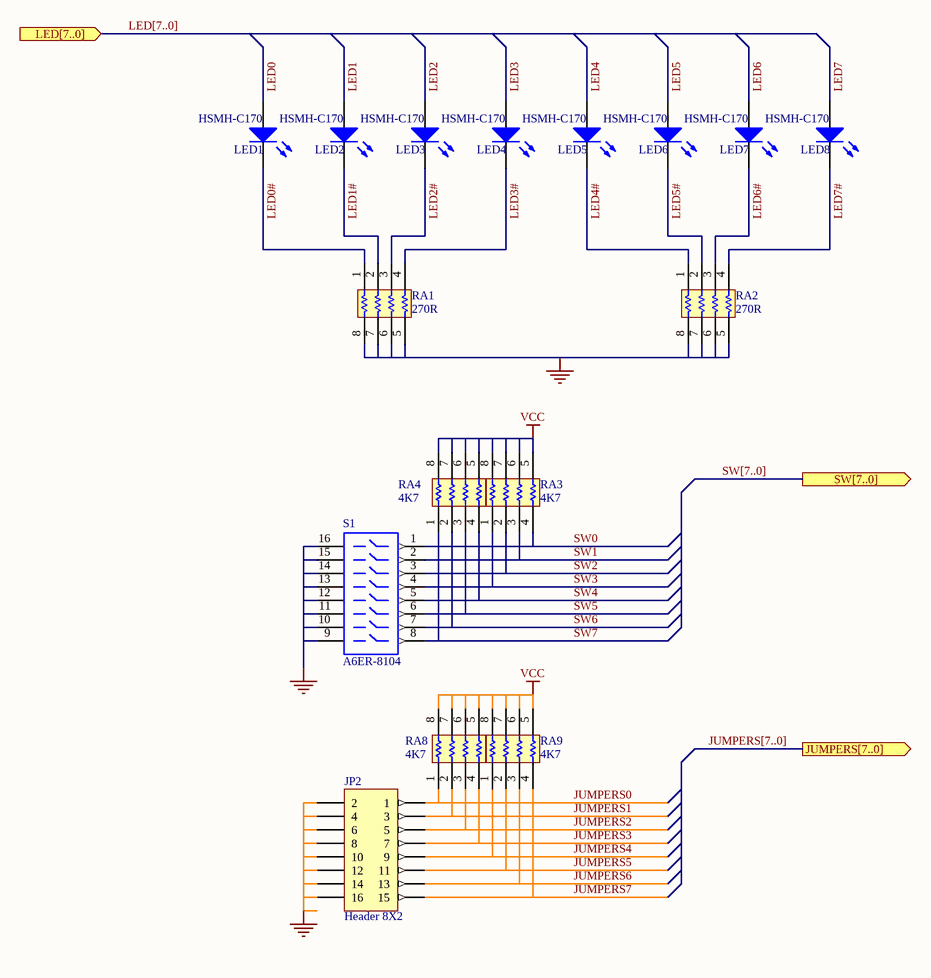
[diagram p6: LED_DIPSWITCH.SchDoc]

### Parts
JP2  Header 8X2  [HDR2X8]
LED1  HSMH-C170  [SMD _LED]
LED2  HSMH-C170  [SMD _LED]
LED3  HSMH-C170  [SMD _LED]
LED4  HSMH-C170  [SMD _LED]
LED5  HSMH-C170  [SMD _LED]
LED6  HSMH-C170  [SMD _LED]
LED7  HSMH-C170  [SMD _LED]
LED8  HSMH-C170  [SMD _LED]
RA1  270R  [MNR34]
RA2  270R  [MNR34]
RA3  4K7  [MNR34]
RA4  4K7  [MNR34]
RA8  4K7  [MNR34]
RA9  4K7  [MNR34]
S1  A6ER-8104  [DIP-16-KEY]

### Ports
JUMPERS[7..0] (out), LED[7..0] (in), SW[7..0] (out)

### Nets
GND: JP2.2 JP2.4 JP2.6 JP2.8 JP2.10 JP2.12 JP2.14 JP2.16 RA1.5 RA1.6 RA1.7 RA1.8 RA2.5 RA2.6 RA2.7 RA2.8 S1.9 S1.10 S1.11 S1.12 S1.13 S1.14 S1.15 S1.16
VCC: RA3.5 RA3.6 RA3.7 RA3.8 RA4.5 RA4.6 RA4.7 RA4.8 RA8.5 RA8.6 RA8.7 RA8.8 RA9.5 RA9.6 RA9.7 RA9.8  [project net VCCO]
JUMPERS0: JP2.1 RA8.1
JUMPERS1: JP2.3 RA8.2
JUMPERS2: JP2.5 RA8.3
JUMPERS3: JP2.7 RA8.4
JUMPERS4: JP2.9 RA9.1
JUMPERS5: JP2.11 RA9.2
JUMPERS6: JP2.13 RA9.3
JUMPERS7: JP2.15 RA9.4
LED0: LED1.1(A)
LED0#: LED1.2(K) RA1.1
LED1: LED2.1(A)
LED1#: LED2.2(K) RA1.2
LED2: LED3.1(A)
LED2#: LED3.2(K) RA1.3
LED3: LED4.1(A)
LED3#: LED4.2(K) RA1.4
LED4: LED5.1(A)
LED4#: LED5.2(K) RA2.1
LED5: LED6.1(A)
LED5#: LED6.2(K) RA2.2
LED6: LED7.1(A)
LED6#: LED7.2(K) RA2.3
LED7: LED8.1(A)
LED7#: LED8.2(K) RA2.4
SW0: RA3.4 S1.1
SW1: RA3.3 S1.2
SW2: RA3.2 S1.3
SW3: RA3.1 S1.4
SW4: RA4.4 S1.5
SW5: RA4.3 S1.6
SW6: RA4.2 S1.7
SW7: RA4.1 S1.8

### Buses and harness runs
bus JUMPERS[7..0] = port JUMPERS[7..0]
bus LED[7..0] = port LED[7..0]
bus SW[7..0] = port SW[7..0]

### Notes on the sheet
- Title
- Size:
- Date:
- A
- Number:
- Time:
- Revision:
- Sheet
- of
- File:

### Library data of the parts
JP2 = Header 8X2: Header, 8-Pin, Dual row; Manufacturer: Generic Components; Class I: Connector; Revision: July-2002: Re-released for DXP Platform.; Publisher: Altium Limited
LED1-LED8 = HSMX-C670: Typical RED GaAs SMD LED Agilent make; Manufacturer: Generic Components; Class I: Optoelectronic; Fitted: True; Published: 8-Jun-2000; Revision: July-2002: Re-released for DXP Platform.; Publisher: Altium Limited; Class II: LED
RA1-RA4 RA8 RA9 = MNR34: 3216x4 Resistor Array; Fitted: True
S1 = A6ER-8104: DIP Switch Side actuator long liver Piano Key; Manufacturer: Generic Components; Fitted: True; Published: 24-Mar-1999; Revision: July-2002: Re-released for DXP Platform.; Publisher: Altium Limited

## Nets that join several sheets
6V: LedMatrixDisplay (16 pins), DIGITS/DG7 (J1_DG7.12 J1_DG7.13 J1_DG7.14), DIGITS/DG6 (J1_DG6.12 J1_DG6.13 J1_DG6.14), DIGITS/DG5 (J1_DG5.12 J1_DG5.13 J1_DG5.14), DIGITS/DG4 (J1_DG4.12 J1_DG4.13 J1_DG4.14), DIGITS/DG3 (J1_DG3.12 J1_DG3.13 J1_DG3.14), DIGITS/DG2 (J1_DG2.12 J1_DG2.13 J1_DG2.14), DIGITS/DG1 (J1_DG1.12 J1_DG1.13 J1_DG1.14), DIGITS/DG8 (J1_DG8.12 J1_DG8.13 J1_DG8.14), Power (9 pins)
GND: LedMatrixDisplay (17 pins), DIGITS/DG7 (J2_DG7.12 J2_DG7.13 J2_DG7.14), DIGITS/DG6 (J2_DG6.12 J2_DG6.13 J2_DG6.14), DIGITS/DG5 (J2_DG5.12 J2_DG5.13 J2_DG5.14), DIGITS/DG4 (J2_DG4.12 J2_DG4.13 J2_DG4.14), DIGITS/DG3 (J2_DG3.12 J2_DG3.13 J2_DG3.14), DIGITS/DG2 (J2_DG2.12 J2_DG2.13 J2_DG2.14), DIGITS/DG1 (J2_DG1.12 J2_DG1.13 J2_DG1.14), DIGITS/DG8 (J2_DG8.12 J2_DG8.13 J2_DG8.14), FPGA_U1_Manual (37 pins), FPGA_U1_Auto (26 pins), Power (16 pins), LED_DIPSWITCH (24 pins)
VCCINT: FPGA_U1_Manual (14 pins), FPGA_U1_Auto (12 pins), Power (C41.1 C44.1 R7.1 U5.2)
VCCO: LedMatrixDisplay (C37.1 U3.1 U3.4), DIGITS/DG7 (J1_DG7.1 J1_DG7.2 J1_DG7.3), DIGITS/DG6 (J1_DG6.1 J1_DG6.2 J1_DG6.3), DIGITS/DG5 (J1_DG5.1 J1_DG5.2 J1_DG5.3), DIGITS/DG4 (J1_DG4.1 J1_DG4.2 J1_DG4.3), DIGITS/DG3 (J1_DG3.1 J1_DG3.2 J1_DG3.3), DIGITS/DG2 (J1_DG2.1 J1_DG2.2 J1_DG2.3), DIGITS/DG1 (J1_DG1.1 J1_DG1.2 J1_DG1.3), DIGITS/DG8 (J1_DG8.1 J1_DG8.2 J1_DG8.3), FPGA_U1_Manual (28 pins), FPGA_U1_Auto (16 pins), Power (C39.1 C42.1 R6.1 U4.2), LED_DIPSWITCH (16 pins)
ADDR0: LedMatrixDisplay (RA7.5), FPGA_U1_Auto (U1.110)
ADDR1: LedMatrixDisplay (RA7.6), FPGA_U1_Auto (U1.109)
ADDR2: LedMatrixDisplay (RA7.7), FPGA_U1_Auto (U1.97)
CCLK: FPGA_U1_Manual (U2.3), FPGA_U1_Auto (U1.155)
CLK_MHZ40: LedMatrixDisplay (R5.2), FPGA_U1_Auto (U1.185)
DATA0: LedMatrixDisplay (RA5.5), FPGA_U1_Auto (U1.99)
DATA1: LedMatrixDisplay (RA5.6), FPGA_U1_Auto (U1.100)
DATA2: LedMatrixDisplay (RA5.7), FPGA_U1_Auto (U1.101)
DATA3: LedMatrixDisplay (RA5.8), FPGA_U1_Auto (U1.102)
DATA4: LedMatrixDisplay (RA6.5), FPGA_U1_Auto (U1.114)
DATA5: LedMatrixDisplay (RA6.6), FPGA_U1_Auto (U1.113)
DATA6: LedMatrixDisplay (RA6.7), FPGA_U1_Auto (U1.112)
DATA7: LedMatrixDisplay (RA6.8), FPGA_U1_Auto (U1.111)
DIN: FPGA_U1_Manual (U2.1), FPGA_U1_Auto (U1.153)
DONE: FPGA_U1_Manual (R4.2 U2.10), FPGA_U1_Auto (U1.104)
ENABLE0: DIGITS/DG1 (J1_DG1.11), FPGA_U1_Auto (U1.132)
ENABLE1: DIGITS/DG2 (J1_DG2.11), FPGA_U1_Auto (U1.150)
ENABLE2: DIGITS/DG3 (J1_DG3.11), FPGA_U1_Auto (U1.168)
ENABLE3: DIGITS/DG4 (J1_DG4.11), FPGA_U1_Auto (U1.68)
ENABLE4: DIGITS/DG5 (J1_DG5.11), FPGA_U1_Auto (U1.193)
ENABLE5: DIGITS/DG6 (J1_DG6.11), FPGA_U1_Auto (U1.204)
ENABLE6: DIGITS/DG7 (J1_DG7.11), FPGA_U1_Auto (U1.8)
ENABLE7: DIGITS/DG8 (J1_DG8.11), FPGA_U1_Auto (U1.22)
FPGA_TDO-TDI: FPGA_U1_Manual (U2.4), FPGA_U1_Auto (U1.157)
GREEN0: DIGITS/DG7 (J2_DG7.1), DIGITS/DG6 (J2_DG6.1), DIGITS/DG5 (J2_DG5.1), DIGITS/DG4 (J2_DG4.1), DIGITS/DG3 (J2_DG3.1), DIGITS/DG2 (J2_DG2.1), DIGITS/DG1 (J2_DG1.1), DIGITS/DG8 (J2_DG8.1), FPGA_U1_Auto (U1.167)
GREEN1: DIGITS/DG7 (J2_DG7.2), DIGITS/DG6 (J2_DG6.2), DIGITS/DG5 (J2_DG5.2), DIGITS/DG4 (J2_DG4.2), DIGITS/DG3 (J2_DG3.2), DIGITS/DG2 (J2_DG2.2), DIGITS/DG1 (J2_DG1.2), DIGITS/DG8 (J2_DG8.2), FPGA_U1_Auto (U1.96)
GREEN2: DIGITS/DG7 (J2_DG7.3), DIGITS/DG6 (J2_DG6.3), DIGITS/DG5 (J2_DG5.3), DIGITS/DG4 (J2_DG4.3), DIGITS/DG3 (J2_DG3.3), DIGITS/DG2 (J2_DG2.3), DIGITS/DG1 (J2_DG1.3), DIGITS/DG8 (J2_DG8.3), FPGA_U1_Auto (U1.135)
GREEN3: DIGITS/DG7 (J2_DG7.4), DIGITS/DG6 (J2_DG6.4), DIGITS/DG5 (J2_DG5.4), DIGITS/DG4 (J2_DG4.4), DIGITS/DG3 (J2_DG3.4), DIGITS/DG2 (J2_DG2.4), DIGITS/DG1 (J2_DG1.4), DIGITS/DG8 (J2_DG8.4), FPGA_U1_Auto (U1.45)
GREEN4: DIGITS/DG7 (J2_DG7.5), DIGITS/DG6 (J2_DG6.5), DIGITS/DG5 (J2_DG5.5), DIGITS/DG4 (J2_DG4.5), DIGITS/DG3 (J2_DG3.5), DIGITS/DG2 (J2_DG2.5), DIGITS/DG1 (J2_DG1.5), DIGITS/DG8 (J2_DG8.5), FPGA_U1_Auto (U1.17)
INIT: FPGA_U1_Manual (R3.2 U2.8), FPGA_U1_Auto (U1.107)
JUMPERS0: FPGA_U1_Auto (U1.33), LED_DIPSWITCH (JP2.1 RA8.1)
JUMPERS1: FPGA_U1_Auto (U1.31), LED_DIPSWITCH (JP2.3 RA8.2)
JUMPERS2: FPGA_U1_Auto (U1.30), LED_DIPSWITCH (JP2.5 RA8.3)
JUMPERS3: FPGA_U1_Auto (U1.21), LED_DIPSWITCH (JP2.7 RA8.4)
JUMPERS4: FPGA_U1_Auto (U1.29), LED_DIPSWITCH (JP2.9 RA9.1)
JUMPERS5: FPGA_U1_Auto (U1.27), LED_DIPSWITCH (JP2.11 RA9.2)
JUMPERS6: FPGA_U1_Auto (U1.24), LED_DIPSWITCH (JP2.13 RA9.3)
JUMPERS7: FPGA_U1_Auto (U1.23), LED_DIPSWITCH (JP2.15 RA9.4)
LED0: FPGA_U1_Auto (U1.35), LED_DIPSWITCH (LED1.1)
LED1: FPGA_U1_Auto (U1.34), LED_DIPSWITCH (LED2.1)
LED2: FPGA_U1_Auto (U1.36), LED_DIPSWITCH (LED3.1)
LED3: FPGA_U1_Auto (U1.40), LED_DIPSWITCH (LED4.1)
LED4: FPGA_U1_Auto (U1.41), LED_DIPSWITCH (LED5.1)
LED5: FPGA_U1_Auto (U1.42), LED_DIPSWITCH (LED6.1)
LED6: FPGA_U1_Auto (U1.43), LED_DIPSWITCH (LED7.1)
LED7: FPGA_U1_Auto (U1.44), LED_DIPSWITCH (LED8.1)
PROGRAM: FPGA_U1_Manual (R2.2 U2.7), FPGA_U1_Auto (U1.106)
RED0: DIGITS/DG7 (J2_DG7.7), DIGITS/DG6 (J2_DG6.7), DIGITS/DG5 (J2_DG5.7), DIGITS/DG4 (J2_DG4.7), DIGITS/DG3 (J2_DG3.7), DIGITS/DG2 (J2_DG2.7), DIGITS/DG1 (J2_DG1.7), DIGITS/DG8 (J2_DG8.7), FPGA_U1_Auto (U1.57)
RED1: DIGITS/DG7 (J2_DG7.8), DIGITS/DG6 (J2_DG6.8), DIGITS/DG5 (J2_DG5.8), DIGITS/DG4 (J2_DG4.8), DIGITS/DG3 (J2_DG3.8), DIGITS/DG2 (J2_DG2.8), DIGITS/DG1 (J2_DG1.8), DIGITS/DG8 (J2_DG8.8), FPGA_U1_Auto (U1.59)
RED2: DIGITS/DG7 (J2_DG7.9), DIGITS/DG6 (J2_DG6.9), DIGITS/DG5 (J2_DG5.9), DIGITS/DG4 (J2_DG4.9), DIGITS/DG3 (J2_DG3.9), DIGITS/DG2 (J2_DG2.9), DIGITS/DG1 (J2_DG1.9), DIGITS/DG8 (J2_DG8.9), FPGA_U1_Auto (U1.60)
RED3: DIGITS/DG7 (J2_DG7.10), DIGITS/DG6 (J2_DG6.10), DIGITS/DG5 (J2_DG5.10), DIGITS/DG4 (J2_DG4.10), DIGITS/DG3 (J2_DG3.10), DIGITS/DG2 (J2_DG2.10), DIGITS/DG1 (J2_DG1.10), DIGITS/DG8 (J2_DG8.10), FPGA_U1_Auto (U1.61)
RED4: DIGITS/DG7 (J2_DG7.11), DIGITS/DG6 (J2_DG6.11), DIGITS/DG5 (J2_DG5.11), DIGITS/DG4 (J2_DG4.11), DIGITS/DG3 (J2_DG3.11), DIGITS/DG2 (J2_DG2.11), DIGITS/DG1 (J2_DG1.11), DIGITS/DG8 (J2_DG8.11), FPGA_U1_Auto (U1.63)
ROWA0: DIGITS/DG1 (J1_DG1.4), FPGA_U1_Auto (U1.115)
ROWA1: DIGITS/DG1 (J1_DG1.5), FPGA_U1_Auto (U1.121)
ROWA2: DIGITS/DG1 (J1_DG1.6), FPGA_U1_Auto (U1.122)
ROWA3: DIGITS/DG1 (J1_DG1.7), FPGA_U1_Auto (U1.123)
ROWA4: DIGITS/DG1 (J1_DG1.8), FPGA_U1_Auto (U1.125)
ROWA5: DIGITS/DG1 (J1_DG1.9), FPGA_U1_Auto (U1.127)
ROWA6: DIGITS/DG1 (J1_DG1.10), FPGA_U1_Auto (U1.129)
ROWB0: DIGITS/DG2 (J1_DG2.4), FPGA_U1_Auto (U1.136)
ROWB1: DIGITS/DG2 (J1_DG2.5), FPGA_U1_Auto (U1.140)
ROWB2: DIGITS/DG2 (J1_DG2.6), FPGA_U1_Auto (U1.141)
ROWB3: DIGITS/DG2 (J1_DG2.7), FPGA_U1_Auto (U1.146)
ROWB4: DIGITS/DG2 (J1_DG2.8), FPGA_U1_Auto (U1.147)
ROWB5: DIGITS/DG2 (J1_DG2.9), FPGA_U1_Auto (U1.148)
ROWB6: DIGITS/DG2 (J1_DG2.10), FPGA_U1_Auto (U1.149)
ROWC0: DIGITS/DG4 (J1_DG4.4), FPGA_U1_Auto (U1.169)
ROWC1: DIGITS/DG4 (J1_DG4.5), FPGA_U1_Auto (U1.173)
ROWC2: DIGITS/DG4 (J1_DG4.6), FPGA_U1_Auto (U1.174)
ROWC3: DIGITS/DG4 (J1_DG4.7), FPGA_U1_Auto (U1.175)
ROWC4: DIGITS/DG4 (J1_DG4.8), FPGA_U1_Auto (U1.176)
ROWC5: DIGITS/DG4 (J1_DG4.9), FPGA_U1_Auto (U1.178)
ROWC6: DIGITS/DG4 (J1_DG4.10), FPGA_U1_Auto (U1.179)
ROWD0: DIGITS/DG6 (J1_DG6.4), FPGA_U1_Auto (U1.194)
ROWD1: DIGITS/DG6 (J1_DG6.5), FPGA_U1_Auto (U1.198)
ROWD2: DIGITS/DG6 (J1_DG6.6), FPGA_U1_Auto (U1.199)
ROWD3: DIGITS/DG6 (J1_DG6.7), FPGA_U1_Auto (U1.200)
ROWD4: DIGITS/DG6 (J1_DG6.8), FPGA_U1_Auto (U1.201)
ROWD5: DIGITS/DG6 (J1_DG6.9), FPGA_U1_Auto (U1.202)
ROWD6: DIGITS/DG6 (J1_DG6.10), FPGA_U1_Auto (U1.203)
ROWE0: DIGITS/DG3 (J1_DG3.4), FPGA_U1_Auto (U1.151)
ROWE1: DIGITS/DG3 (J1_DG3.5), FPGA_U1_Auto (U1.152)
ROWE2: DIGITS/DG3 (J1_DG3.6), FPGA_U1_Auto (U1.162)
ROWE3: DIGITS/DG3 (J1_DG3.7), FPGA_U1_Auto (U1.163)
ROWE4: DIGITS/DG3 (J1_DG3.8), FPGA_U1_Auto (U1.164)
ROWE5: DIGITS/DG3 (J1_DG3.9), FPGA_U1_Auto (U1.165)
ROWE6: DIGITS/DG3 (J1_DG3.10), FPGA_U1_Auto (U1.166)
ROWF0: DIGITS/DG8 (J1_DG8.4), FPGA_U1_Auto (U1.9)
ROWF1: DIGITS/DG8 (J1_DG8.5), FPGA_U1_Auto (U1.10)
ROWF2: DIGITS/DG8 (J1_DG8.6), FPGA_U1_Auto (U1.11)
ROWF3: DIGITS/DG8 (J1_DG8.7), FPGA_U1_Auto (U1.15)
ROWF4: DIGITS/DG8 (J1_DG8.8), FPGA_U1_Auto (U1.16)
ROWF5: DIGITS/DG8 (J1_DG8.9), FPGA_U1_Auto (U1.18)
ROWF6: DIGITS/DG8 (J1_DG8.10), FPGA_U1_Auto (U1.20)
ROWG0: DIGITS/DG7 (J1_DG7.4), FPGA_U1_Auto (U1.205)
ROWG1: DIGITS/DG7 (J1_DG7.5), FPGA_U1_Auto (U1.206)
ROWG2: DIGITS/DG7 (J1_DG7.6), FPGA_U1_Auto (U1.4)
ROWG3: DIGITS/DG7 (J1_DG7.7), FPGA_U1_Auto (U1.3)
ROWG4: DIGITS/DG7 (J1_DG7.8), FPGA_U1_Auto (U1.5)
ROWG5: DIGITS/DG7 (J1_DG7.9), FPGA_U1_Auto (U1.6)
ROWG6: DIGITS/DG7 (J1_DG7.10), FPGA_U1_Auto (U1.7)
ROWH0: DIGITS/DG5 (J1_DG5.4), FPGA_U1_Auto (U1.180)
ROWH1: DIGITS/DG5 (J1_DG5.5), FPGA_U1_Auto (U1.181)
ROWH2: DIGITS/DG5 (J1_DG5.6), FPGA_U1_Auto (U1.187)
ROWH3: DIGITS/DG5 (J1_DG5.7), FPGA_U1_Auto (U1.188)
ROWH4: DIGITS/DG5 (J1_DG5.8), FPGA_U1_Auto (U1.189)
ROWH5: DIGITS/DG5 (J1_DG5.9), FPGA_U1_Auto (U1.191)
ROWH6: DIGITS/DG5 (J1_DG5.10), FPGA_U1_Auto (U1.192)
SPARTAN_M0: FPGA_U1_Manual (JP1.1 R1.2), FPGA_U1_Auto (U1.52)
SW0: FPGA_U1_Auto (U1.46), LED_DIPSWITCH (RA3.4 S1.1)
SW1: FPGA_U1_Auto (U1.47), LED_DIPSWITCH (RA3.3 S1.2)
SW2: FPGA_U1_Auto (U1.48), LED_DIPSWITCH (RA3.2 S1.3)
SW3: FPGA_U1_Auto (U1.49), LED_DIPSWITCH (RA3.1 S1.4)
SW4: FPGA_U1_Auto (U1.62), LED_DIPSWITCH (RA4.4 S1.5)
SW5: FPGA_U1_Auto (U1.58), LED_DIPSWITCH (RA4.3 S1.6)
SW6: FPGA_U1_Auto (U1.56), LED_DIPSWITCH (RA4.2 S1.7)
SW7: FPGA_U1_Auto (U1.55), LED_DIPSWITCH (RA4.1 S1.8)
TCK_HARD: LedMatrixDisplay (J5.3), FPGA_U1_Manual (U2.6), FPGA_U1_Auto (U1.207)
TCK_SOFT: LedMatrixDisplay (J5.7), FPGA_U1_Auto (U1.139)
TDI_HARD: LedMatrixDisplay (J5.1), FPGA_U1_Auto (U1.159)
TDI_SOFT: LedMatrixDisplay (J5.5), FPGA_U1_Auto (U1.138)
TDO_HARD: LedMatrixDisplay (J5.2), FPGA_U1_Manual (U2.17)
TDO_SOFT: LedMatrixDisplay (J5.6), FPGA_U1_Auto (U1.133)
TMS_HARD: LedMatrixDisplay (J5.4), FPGA_U1_Manual (U2.5), FPGA_U1_Auto (U1.2)
TMS_SOFT: LedMatrixDisplay (J5.8), FPGA_U1_Auto (U1.134)
WR: LedMatrixDisplay (RA7.8), FPGA_U1_Auto (U1.98)
WR_REG: LedMatrixDisplay (R12.1), FPGA_U1_Auto (U1.86)